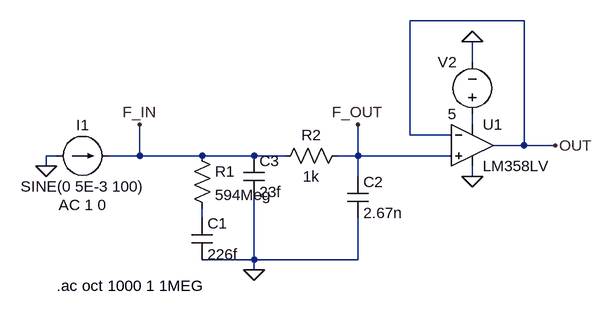
[diagram p0: schematic 3orderLPF.asc]
3orderLPF.asc, the LTspice schematic file:
Version 4
SHEET 1 880 680
WIRE 656 -96 480 -96
WIRE 576 -32 576 -64
WIRE 576 64 576 48
WIRE 480 80 480 -96
WIRE 544 80 480 80
WIRE 656 96 656 -96
WIRE 656 96 608 96
WIRE 704 96 656 96
WIRE -64 112 -80 112
WIRE 64 112 64 64
WIRE 64 112 16 112
WIRE 160 112 64 112
WIRE 240 112 160 112
WIRE 288 112 240 112
WIRE 400 112 400 64
WIRE 400 112 368 112
WIRE 544 112 400 112
WIRE -80 128 -80 112
WIRE 400 144 400 112
WIRE 576 144 576 128
WIRE 160 208 160 192
WIRE 240 272 240 176
WIRE 240 272 160 272
WIRE 400 272 400 208
WIRE 400 272 240 272
WIRE 240 288 240 272
FLAG 240 288 0
FLAG 576 144 0
FLAG 576 -64 0
FLAG 704 96 OUT
FLAG -80 128 0
FLAG 400 64 F_OUT
FLAG 64 64 F_IN
SYMBOL ZZZ\\OpAmp\\LM358LV 576 32 R0
SYMATTR InstName U1
SYMBOL voltage 576 64 R180
WINDOW 0 24 96 Left 2
WINDOW 3 24 16 Left 2
WINDOW 123 0 0 Left 0
WINDOW 39 0 0 Left 0
SYMATTR InstName V2
SYMATTR Value 5
SYMBOL current -64 112 R270
WINDOW 0 32 40 VTop 2
WINDOW 3 -32 40 VBottom 2
WINDOW 123 -60 40 VBottom 2
WINDOW 39 0 0 Left 0
SYMATTR InstName I1
SYMATTR Value SINE(0 5E-3 100)
SYMATTR Value2 AC 1 0
SYMBOL cap 224 112 R0
SYMATTR InstName C3
SYMATTR Value 23f
SYMBOL cap 144 208 R0
SYMATTR InstName C1
SYMATTR Value 226f
SYMBOL res 144 96 R0
SYMATTR InstName R1
SYMATTR Value 594Meg
SYMBOL res 384 96 R90
WINDOW 0 0 56 VBottom 2
WINDOW 3 32 56 VTop 2
SYMATTR InstName R2
SYMATTR Value 1k
SYMBOL cap 384 144 R0
SYMATTR InstName C2
SYMATTR Value 2.67n
TEXT -64 312 Left 2 !.ac oct 1000 1 1MEG

The netlist it stands for:
* 3orderLPF.asc
* U1: LM358LV (symbol ZZZ\OpAmp\LM358LV not available, pins judged from their places): In+=F_OUT In-=OUT V+=N001 V-=0 OUT=OUT
V2 N001 0 5
I1 0 F_IN SINE(0 5E-3 100) AC 1 0
C3 F_IN 0 23f
C1 N002 0 226f
R1 F_IN N002 594Meg
R2 F_OUT F_IN 1k
C2 F_OUT 0 2.67n
.ac oct 1000 1 1MEG
.backanno
.end